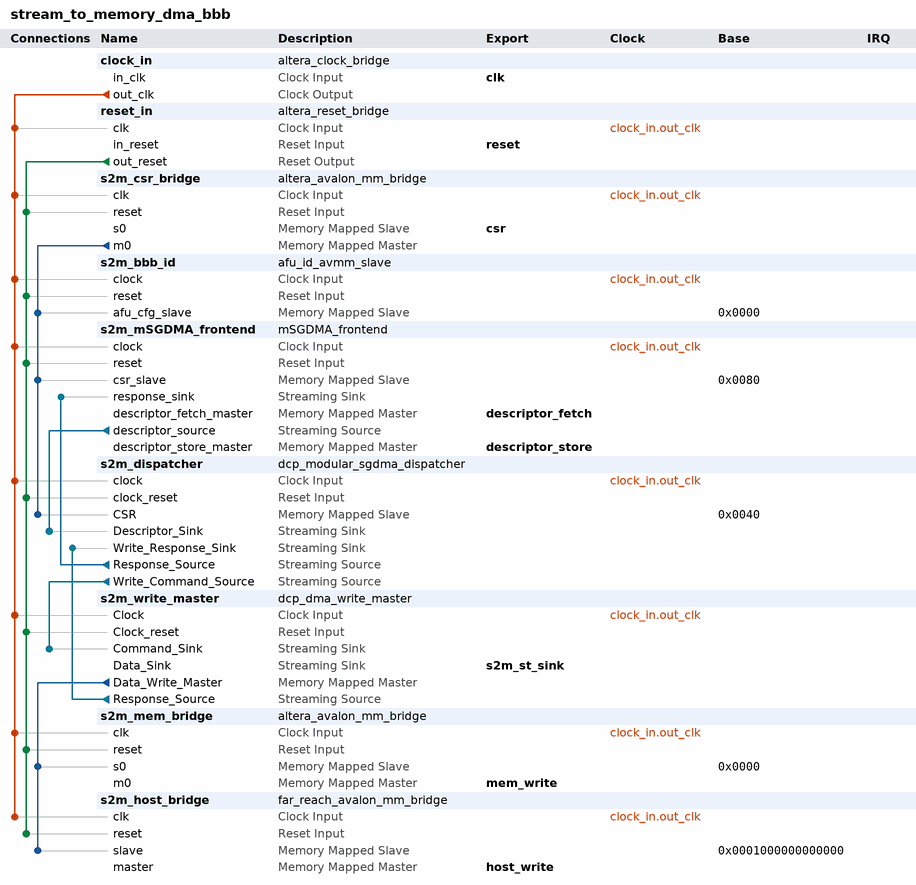
[diagram p0: system contents]
# Platform Designer (Qsys) system stream_to_memory_dma_bbb, Stratix 10 1SX280HN2F43E2VG
# Parameters at their usual value, and those the tool derives, are not listed.
package require -exact qsys 1.0
create_system stream_to_memory_dma_bbb
set_project_property DEVICE_FAMILY {Stratix 10}
set_project_property DEVICE 1SX280HN2F43E2VG

add_component clock_in ip/stream_to_memory_dma_bbb/stream_to_memory_dma_bbb_clock_in.ip altera_clock_bridge clock_in 17.1

add_component reset_in ip/stream_to_memory_dma_bbb/stream_to_memory_dma_bbb_reset_in.ip altera_reset_bridge reset_in 17.1

add_component s2m_csr_bridge ip/stream_to_memory_dma_bbb/stream_to_memory_dma_bbb_csr_bridge.ip altera_avalon_mm_bridge s2m_csr_bridge 17.1

add_component s2m_bbb_id ip/stream_to_memory_dma_bbb/stream_to_memory_dma_bbb_id.ip afu_id_avmm_slave s2m_bbb_id 1.0

add_component s2m_mSGDMA_frontend ip/stream_to_memory_dma_bbb/stream_to_memory_dma_bbb_mSGDMA_frontend.ip mSGDMA_frontend s2m_mSGDMA_frontend 1.0

add_component s2m_dispatcher ip/stream_to_memory_dma_bbb/stream_to_memory_dma_bbb_dcp_modular_sgdma_dispatcher.ip dcp_modular_sgdma_dispatcher s2m_dispatcher 17.0

add_component s2m_write_master ip/stream_to_memory_dma_bbb/stream_to_memory_dma_bbb_write_master.ip dcp_dma_write_master s2m_write_master 17.0

add_component s2m_mem_bridge ip/stream_to_memory_dma_bbb/stream_to_memory_dma_bbb_memory_bridge.ip altera_avalon_mm_bridge s2m_mem_bridge 17.1

add_component s2m_host_bridge ip/stream_to_memory_dma_bbb/stream_to_memory_dma_bbb_host_bridge.ip far_reach_avalon_mm_bridge s2m_host_bridge 1.0

# connections
add_connection clock_in.out_clk reset_in.clk clock
add_connection clock_in.out_clk s2m_bbb_id.clock clock
add_connection clock_in.out_clk s2m_csr_bridge.clk clock
add_connection clock_in.out_clk s2m_dispatcher.clock clock
add_connection clock_in.out_clk s2m_host_bridge.clk clock
add_connection clock_in.out_clk s2m_mem_bridge.clk clock
add_connection clock_in.out_clk s2m_mSGDMA_frontend.clock clock
add_connection clock_in.out_clk s2m_write_master.Clock clock
add_connection reset_in.out_reset s2m_bbb_id.reset reset
add_connection reset_in.out_reset s2m_csr_bridge.reset reset
add_connection reset_in.out_reset s2m_dispatcher.clock_reset reset
add_connection reset_in.out_reset s2m_host_bridge.reset reset
add_connection reset_in.out_reset s2m_mem_bridge.reset reset
add_connection reset_in.out_reset s2m_mSGDMA_frontend.reset reset
add_connection reset_in.out_reset s2m_write_master.Clock_reset reset
add_connection s2m_csr_bridge.m0 s2m_bbb_id.afu_cfg_slave avalon
set_connection_parameter_value s2m_csr_bridge.m0/s2m_bbb_id.afu_cfg_slave baseAddress 0x0000
add_connection s2m_csr_bridge.m0 s2m_dispatcher.CSR avalon
set_connection_parameter_value s2m_csr_bridge.m0/s2m_dispatcher.CSR baseAddress 0x0040
add_connection s2m_csr_bridge.m0 s2m_mSGDMA_frontend.csr_slave avalon
set_connection_parameter_value s2m_csr_bridge.m0/s2m_mSGDMA_frontend.csr_slave baseAddress 0x0080
add_connection s2m_write_master.Data_Write_Master s2m_host_bridge.slave avalon
set_connection_parameter_value s2m_write_master.Data_Write_Master/s2m_host_bridge.slave baseAddress 0x0001000000000000
add_connection s2m_write_master.Data_Write_Master s2m_mem_bridge.s0 avalon
set_connection_parameter_value s2m_write_master.Data_Write_Master/s2m_mem_bridge.s0 baseAddress 0x0000
add_connection s2m_dispatcher.Response_Source s2m_mSGDMA_frontend.response_sink avalon_streaming
add_connection s2m_dispatcher.Write_Command_Source s2m_write_master.Command_Sink avalon_streaming
add_connection s2m_mSGDMA_frontend.descriptor_source s2m_dispatcher.Descriptor_Sink avalon_streaming
add_connection s2m_write_master.Response_Source s2m_dispatcher.Write_Response_Sink avalon_streaming

# exported interfaces
add_interface clk clock sink
set_interface_property clk EXPORT_OF clock_in.in_clk
add_interface csr avalon slave
set_interface_property csr EXPORT_OF s2m_csr_bridge.s0
add_interface descriptor_fetch avalon master
set_interface_property descriptor_fetch EXPORT_OF s2m_mSGDMA_frontend.descriptor_fetch_master
add_interface descriptor_store avalon master
set_interface_property descriptor_store EXPORT_OF s2m_mSGDMA_frontend.descriptor_store_master
add_interface host_write avalon master
set_interface_property host_write EXPORT_OF s2m_host_bridge.master
add_interface mem_write avalon master
set_interface_property mem_write EXPORT_OF s2m_mem_bridge.m0
add_interface reset reset sink
set_interface_property reset EXPORT_OF reset_in.in_reset
add_interface s2m_st_sink avalon_streaming sink
set_interface_property s2m_st_sink EXPORT_OF s2m_write_master.Data_Sink

set_interconnect_requirement {$system} qsys_mm.clockCrossingAdapter HANDSHAKE
set_interconnect_requirement {$system} qsys_mm.enableEccProtection FALSE
set_interconnect_requirement {$system} qsys_mm.insertDefaultSlave FALSE
set_interconnect_requirement {$system} qsys_mm.maxAdditionalLatency 2

save_system stream_to_memory_dma_bbb.qsys
